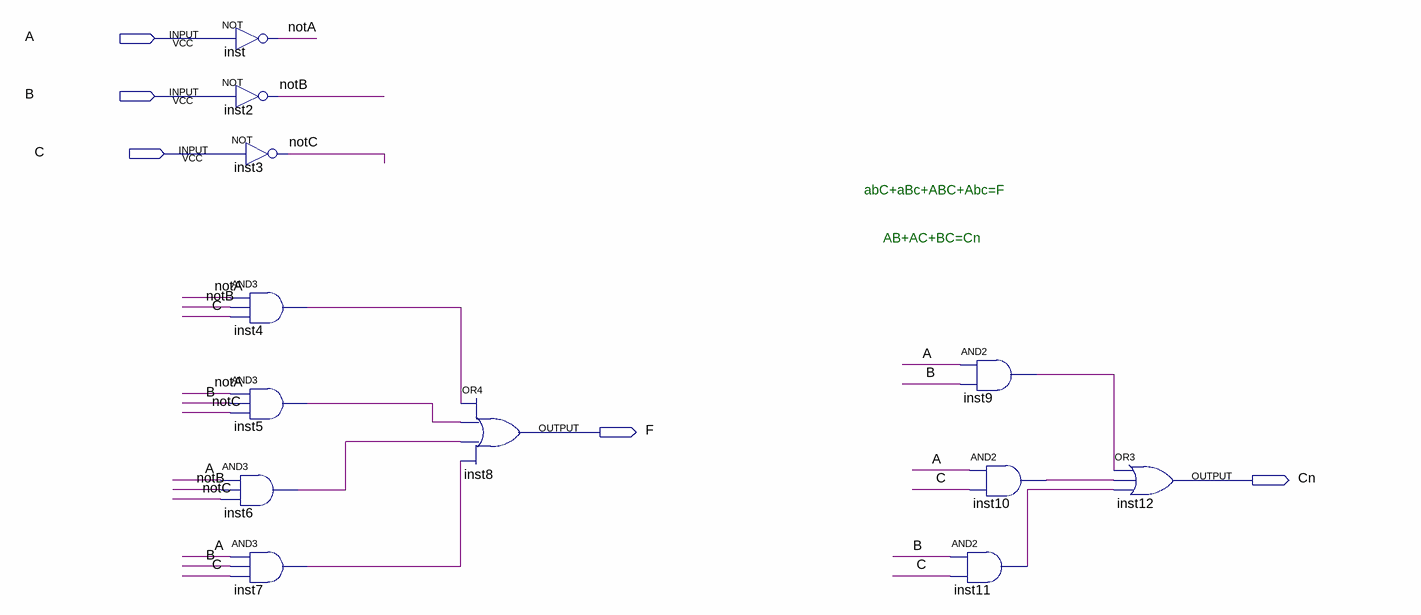
[diagram p0: schematic sheet]
// Quartus schematic ADD1.bdf as structural Verilog: 12 symbols, 5 pins
module ADD1 (
  input  A,
  input  B,
  input  C,
  output F,
  output Cn
);

  wire inst4_out, inst5_out, inst6_out, inst7_out, inst9_out, inst10_out, inst11_out, notA, notB, notC;

  not inst (notA, A);
  not inst2 (notB, B);
  not inst3 (notC, C);
  and inst4 (inst4_out, notA, notB, C);
  and inst5 (inst5_out, notA, B, notC);
  and inst6 (inst6_out, A, notB, notC);
  and inst7 (inst7_out, A, B, C);
  or inst8 (F, inst4_out, inst5_out, inst6_out, inst7_out);
  and inst11 (inst11_out, B, C);
  and inst9 (inst9_out, A, B);
  and inst10 (inst10_out, A, C);
  or inst12 (Cn, inst9_out, inst10_out, inst11_out);

  // Notes on the sheet:
  //   abC+aBc+ABC+Abc=F
  //   AB+AC+BC=Cn
endmodule
